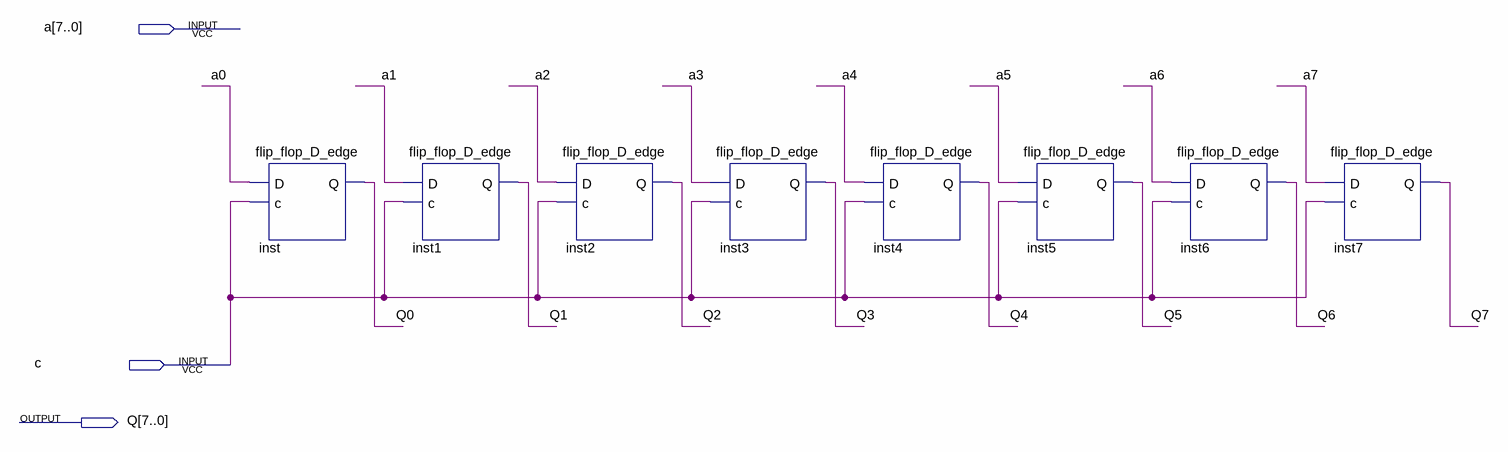
[diagram p0: schematic sheet]
// Quartus schematic register.bdf as structural Verilog: 8 symbols, 3 pins
module register (
  input  [7:0] a,
  input  c,
  output [7:0] Q
);

  flip_flop_D_edge inst (.D(a[0]), .c(c), .Q(Q[0]));
  flip_flop_D_edge inst1 (.D(a[1]), .c(c), .Q(Q[1]));
  flip_flop_D_edge inst2 (.D(a[2]), .c(c), .Q(Q[2]));
  flip_flop_D_edge inst3 (.D(a[3]), .c(c), .Q(Q[3]));
  flip_flop_D_edge inst4 (.D(a[4]), .c(c), .Q(Q[4]));
  flip_flop_D_edge inst5 (.D(a[5]), .c(c), .Q(Q[5]));
  flip_flop_D_edge inst6 (.D(a[6]), .c(c), .Q(Q[6]));
  flip_flop_D_edge inst7 (.D(a[7]), .c(c), .Q(Q[7]));
endmodule
